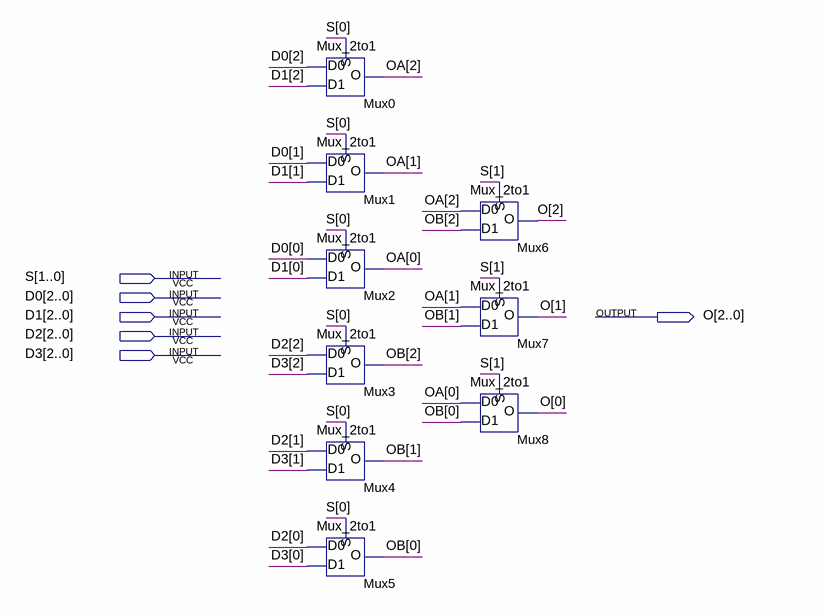
[diagram p0: schematic sheet]
// Quartus schematic Mux3_2to1.bdf as structural Verilog: 9 symbols, 6 pins
module Mux3_2to1 (
  input  [1:0] S,
  input  [2:0] D0,
  input  [2:0] D1,
  input  [2:0] D2,
  input  [2:0] D3,
  output [2:0] O
);

  wire [2:0] OA, OB;

  Mux_2to1 Mux0 (.S(S[0]), .D0(D0[2]), .D1(D1[2]), .O(OA[2]));
  Mux_2to1 Mux1 (.S(S[0]), .D0(D0[1]), .D1(D1[1]), .O(OA[1]));
  Mux_2to1 Mux2 (.S(S[0]), .D0(D0[0]), .D1(D1[0]), .O(OA[0]));
  Mux_2to1 Mux3 (.S(S[0]), .D0(D2[2]), .D1(D3[2]), .O(OB[2]));
  Mux_2to1 Mux4 (.S(S[0]), .D0(D2[1]), .D1(D3[1]), .O(OB[1]));
  Mux_2to1 Mux5 (.S(S[0]), .D0(D2[0]), .D1(D3[0]), .O(OB[0]));
  Mux_2to1 Mux6 (.S(S[1]), .D0(OA[2]), .D1(OB[2]), .O(O[2]));
  Mux_2to1 Mux7 (.S(S[1]), .D0(OA[1]), .D1(OB[1]), .O(O[1]));
  Mux_2to1 Mux8 (.S(S[1]), .D0(OA[0]), .D1(OB[0]), .O(O[0]));
endmodule
